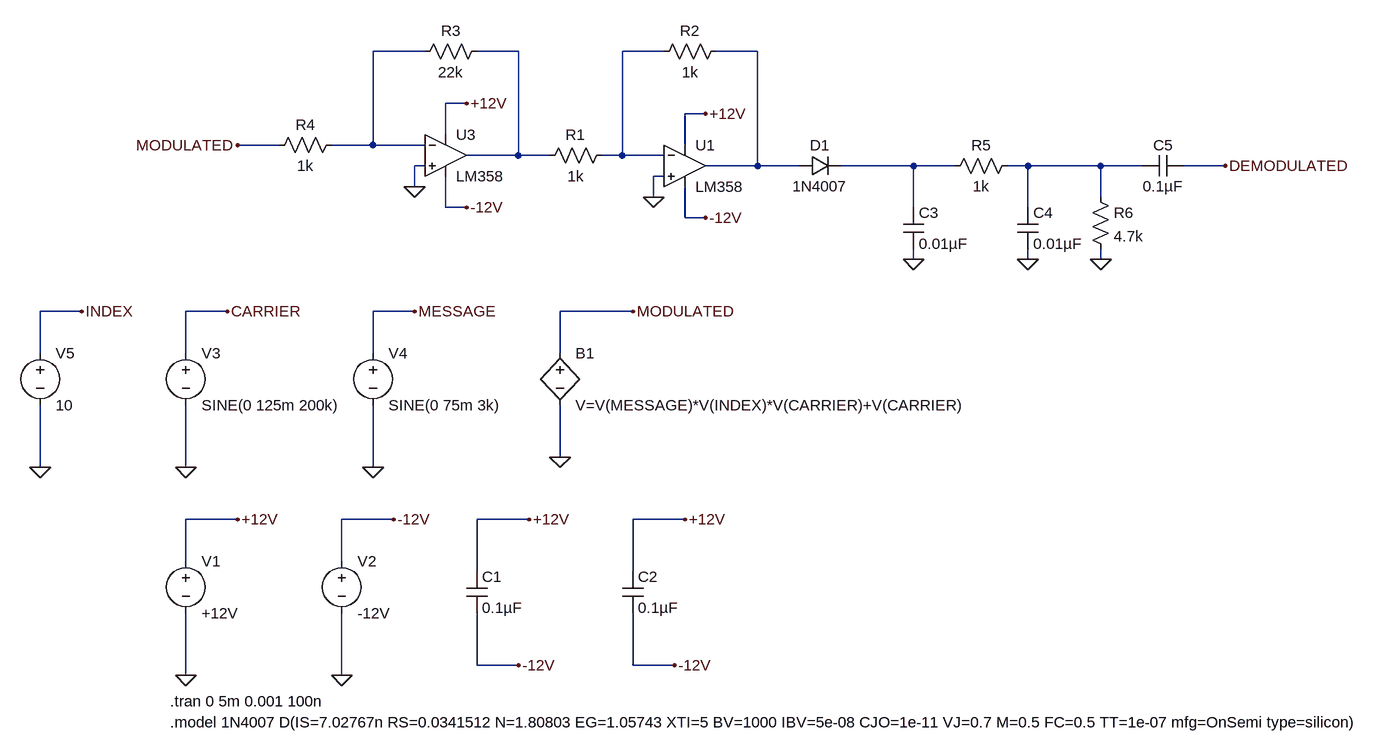
[diagram p0: schematic amplitude_modulation_demodulation.asc]
amplitude_modulation_demodulation.asc, the LTspice schematic file:
Version 4
SHEET 1 1508 680
WIRE -208 -528 -288 -528
WIRE -64 -528 -128 -528
WIRE 160 -528 96 -528
WIRE 304 -528 240 -528
WIRE -144 -448 -176 -448
WIRE 224 -432 192 -432
WIRE -176 -400 -176 -448
WIRE -432 -384 -496 -384
WIRE -288 -384 -288 -528
WIRE -288 -384 -352 -384
WIRE -208 -384 -288 -384
WIRE 192 -384 192 -432
WIRE -64 -368 -64 -528
WIRE -64 -368 -144 -368
WIRE -16 -368 -64 -368
WIRE 96 -368 96 -528
WIRE 96 -368 64 -368
WIRE 160 -368 96 -368
WIRE -208 -352 -224 -352
WIRE 304 -352 304 -528
WIRE 304 -352 224 -352
WIRE 368 -352 304 -352
WIRE 544 -352 432 -352
WIRE 608 -352 544 -352
WIRE 720 -352 688 -352
WIRE 832 -352 720 -352
WIRE 896 -352 832 -352
WIRE 1024 -352 960 -352
WIRE 160 -336 144 -336
WIRE -224 -320 -224 -352
WIRE 144 -304 144 -336
WIRE 832 -304 832 -352
WIRE -176 -288 -176 -336
WIRE -144 -288 -176 -288
WIRE 544 -288 544 -352
WIRE 720 -288 720 -352
WIRE 192 -272 192 -320
WIRE 224 -272 192 -272
WIRE 544 -208 544 -224
WIRE 720 -208 720 -224
WIRE 832 -208 832 -224
WIRE -736 -128 -800 -128
WIRE -512 -128 -576 -128
WIRE -224 -128 -288 -128
WIRE 112 -128 0 -128
WIRE -800 -64 -800 -128
WIRE -576 -64 -576 -128
WIRE -288 -64 -288 -128
WIRE 0 -64 0 -128
WIRE 0 96 0 16
WIRE -800 112 -800 16
WIRE -576 112 -576 16
WIRE -288 112 -288 16
WIRE -496 192 -576 192
WIRE -256 192 -336 192
WIRE -48 192 -128 192
WIRE 192 192 112 192
WIRE -576 256 -576 192
WIRE -336 256 -336 192
WIRE -128 272 -128 192
WIRE 112 272 112 192
WIRE -128 416 -128 336
WIRE -64 416 -128 416
WIRE 112 416 112 336
WIRE 176 416 112 416
WIRE -576 432 -576 336
WIRE -336 432 -336 336
FLAG -576 432 0
FLAG -576 112 0
FLAG -288 112 0
FLAG -512 -128 CARRIER
FLAG -224 -128 MESSAGE
FLAG -336 432 0
FLAG 0 96 0
FLAG 112 -128 MODULATED
FLAG -496 192 +12V
FLAG -256 192 -12V
FLAG -144 -448 +12V
FLAG -144 -288 -12V
FLAG 224 -432 +12V
FLAG 224 -272 -12V
FLAG -224 -320 0
FLAG 144 -304 0
FLAG -496 -384 MODULATED
FLAG -48 192 +12V
FLAG -64 416 -12V
FLAG 544 -208 0
FLAG 720 -208 0
FLAG 832 -208 0
FLAG 1024 -352 DEMODULATED
FLAG 192 192 +12V
FLAG 176 416 -12V
FLAG -800 112 0
FLAG -736 -128 INDEX
SYMBOL voltage -576 240 R0
WINDOW 123 0 0 Left 0
WINDOW 39 0 0 Left 0
SYMATTR InstName V1
SYMATTR Value +12V
SYMBOL voltage -576 -80 R0
WINDOW 123 0 0 Left 0
WINDOW 39 0 0 Left 0
SYMATTR InstName V3
SYMATTR Value SINE(0 125m 200k)
SYMBOL voltage -288 -80 R0
WINDOW 123 0 0 Left 0
WINDOW 39 0 0 Left 0
SYMATTR InstName V4
SYMATTR Value SINE(0 75m 3k)
SYMBOL voltage -336 240 R0
WINDOW 123 0 0 Left 0
WINDOW 39 0 0 Left 0
SYMATTR InstName V2
SYMATTR Value -12V
SYMBOL bv 0 -80 R0
SYMATTR InstName B1
SYMATTR Value V=V(MESSAGE)*V(INDEX)*V(CARRIER)+V(CARRIER)
SYMBOL res 80 -384 R90
WINDOW 0 0 56 VBottom 2
WINDOW 3 32 56 VTop 2
SYMATTR InstName R1
SYMATTR Value 1k
SYMBOL res 256 -544 R90
WINDOW 0 0 56 VBottom 2
WINDOW 3 32 56 VTop 2
SYMATTR InstName R2
SYMATTR Value 1k
SYMBOL res -112 -544 R90
WINDOW 0 0 56 VBottom 2
WINDOW 3 32 56 VTop 2
SYMATTR InstName R3
SYMATTR Value 22k
SYMBOL res -336 -400 R90
WINDOW 0 0 56 VBottom 2
WINDOW 3 32 56 VTop 2
SYMATTR InstName R4
SYMATTR Value 1k
SYMBOL cap -144 272 R0
SYMATTR InstName C1
SYMATTR Value 0.1µF
SYMBOL diode 368 -336 R270
WINDOW 0 32 32 VTop 2
WINDOW 3 0 32 VBottom 2
SYMATTR InstName D1
SYMATTR Value 1N4007
SYMBOL cap 528 -288 R0
SYMATTR InstName C3
SYMATTR Value 0.01µF
SYMBOL res 704 -368 R90
WINDOW 0 0 56 VBottom 2
WINDOW 3 32 56 VTop 2
SYMATTR InstName R5
SYMATTR Value 1k
SYMBOL cap 704 -288 R0
SYMATTR InstName C4
SYMATTR Value 0.01µF
SYMBOL res 816 -320 R0
SYMATTR InstName R6
SYMATTR Value 4.7k
SYMBOL cap 960 -368 R90
WINDOW 0 0 32 VBottom 2
WINDOW 3 32 32 VTop 2
SYMATTR InstName C5
SYMATTR Value 0.1µF
SYMBOL cap 96 272 R0
SYMATTR InstName C2
SYMATTR Value 0.1µF
SYMBOL OpAmps\\opamp2 -176 -432 R0
SYMATTR InstName U3
SYMATTR Value LM358
SYMBOL OpAmps\\opamp2 192 -416 R0
SYMATTR InstName U1
SYMATTR Value LM358
SYMBOL voltage -800 -80 R0
WINDOW 123 0 0 Left 0
WINDOW 39 0 0 Left 0
SYMATTR InstName V5
SYMATTR Value 10
TEXT -600 472 Left 2 !.tran 0 5m 0.001 100n
TEXT -600 504 Left 2 !.model 1N4007 D(IS=7.02767n RS=0.0341512 N=1.80803 EG=1.05743 XTI=5 BV=1000 IBV=5e-08 CJO=1e-11 VJ=0.7 M=0.5 FC=0.5 TT=1e-07 mfg=OnSemi type=silicon)

The netlist it stands for:
* amplitude_modulation_demodulation.asc
V1 +12V 0 +12V
V3 CARRIER 0 SINE(0 125m 200k)
V4 MESSAGE 0 SINE(0 75m 3k)
V2 -12V 0 -12V
B1 MODULATED 0 V=V(MESSAGE)*V(INDEX)*V(CARRIER)+V(CARRIER)
R1 N003 N002 1k
R2 N004 N003 1k
R3 N002 N001 22k
R4 N001 MODULATED 1k
C1 +12V -12V 0.1µF
D1 N004 N005 1N4007
C3 N005 0 0.01µF
R5 N006 N005 1k
C4 N006 0 0.01µF
R6 N006 0 4.7k
C5 DEMODULATED N006 0.1µF
C2 +12V -12V 0.1µF
XU3 0 N001 +12V -12V N002 LM358  ; pins In+ In- V+ V- OUT
XU1 0 N003 +12V -12V N004 LM358  ; pins In+ In- V+ V- OUT
V5 INDEX 0 10
.model D D
.lib standard.dio
.tran 0 5m 0.001 100n
.model 1N4007 D(IS=7.02767n RS=0.0341512 N=1.80803 EG=1.05743 XTI=5 BV=1000 IBV=5e-08 CJO=1e-11 VJ=0.7 M=0.5 FC=0.5 TT=1e-07 mfg=OnSemi type=silicon)
.backanno
.end